# EAGLE schematic switchboard (EAGLE 6.5.0)
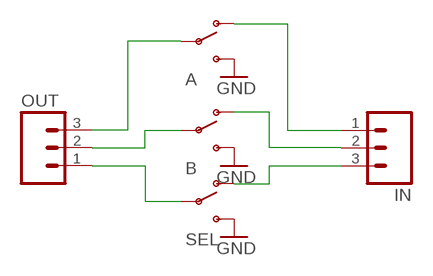
[diagram p0: schematic, sheet 1]

## Parts
A  SWITCH-SPDTPTH  [SWITCH-SPDT]
B  SWITCH-SPDTPTH  [SWITCH-SPDT]
IN  M03LOCK  [1X03_LOCK]
OUT  M03LOCK  [1X03_LOCK]
SEL  SWITCH-SPDTPTH  [SWITCH-SPDT]

## Nets
GND: A.3(S) B.3(S) SEL.3(S)
N$1: A.2(P) OUT.3
N$2: B.2(P) OUT.2
N$3: OUT.1 SEL.2(P)
N$4: A.1(O) IN.1
N$5: B.1(O) IN.2
N$6: IN.3 SEL.1(O)

## Library data of the parts
A B SEL = SparkFun-Electromechanical:SWITCH-SPDT: SPDT Switch Simple slide switch, Spark Fun Electronics SKU : COM-00102 DPDT SMT slide switch, AYZ0202, SWCH-08179
IN OUT = SparkFun-Connectors:M03: Header 3 Standard 3-pin 0.1" header. Use with straight break away headers (SKU : PRT-00116), right angle break away headers (PRT-00553), swiss pins (PRT-00743), machine pins (PRT-00117), and female headers (PRT-00115). Molex polarized connector foot print use with SKU : PRT-08232 with associated crimp pins and housings.